# EAGLE schematic reg-board (EAGLE 8.7.0)

## Sheet 1 of 6: Bus Buffering
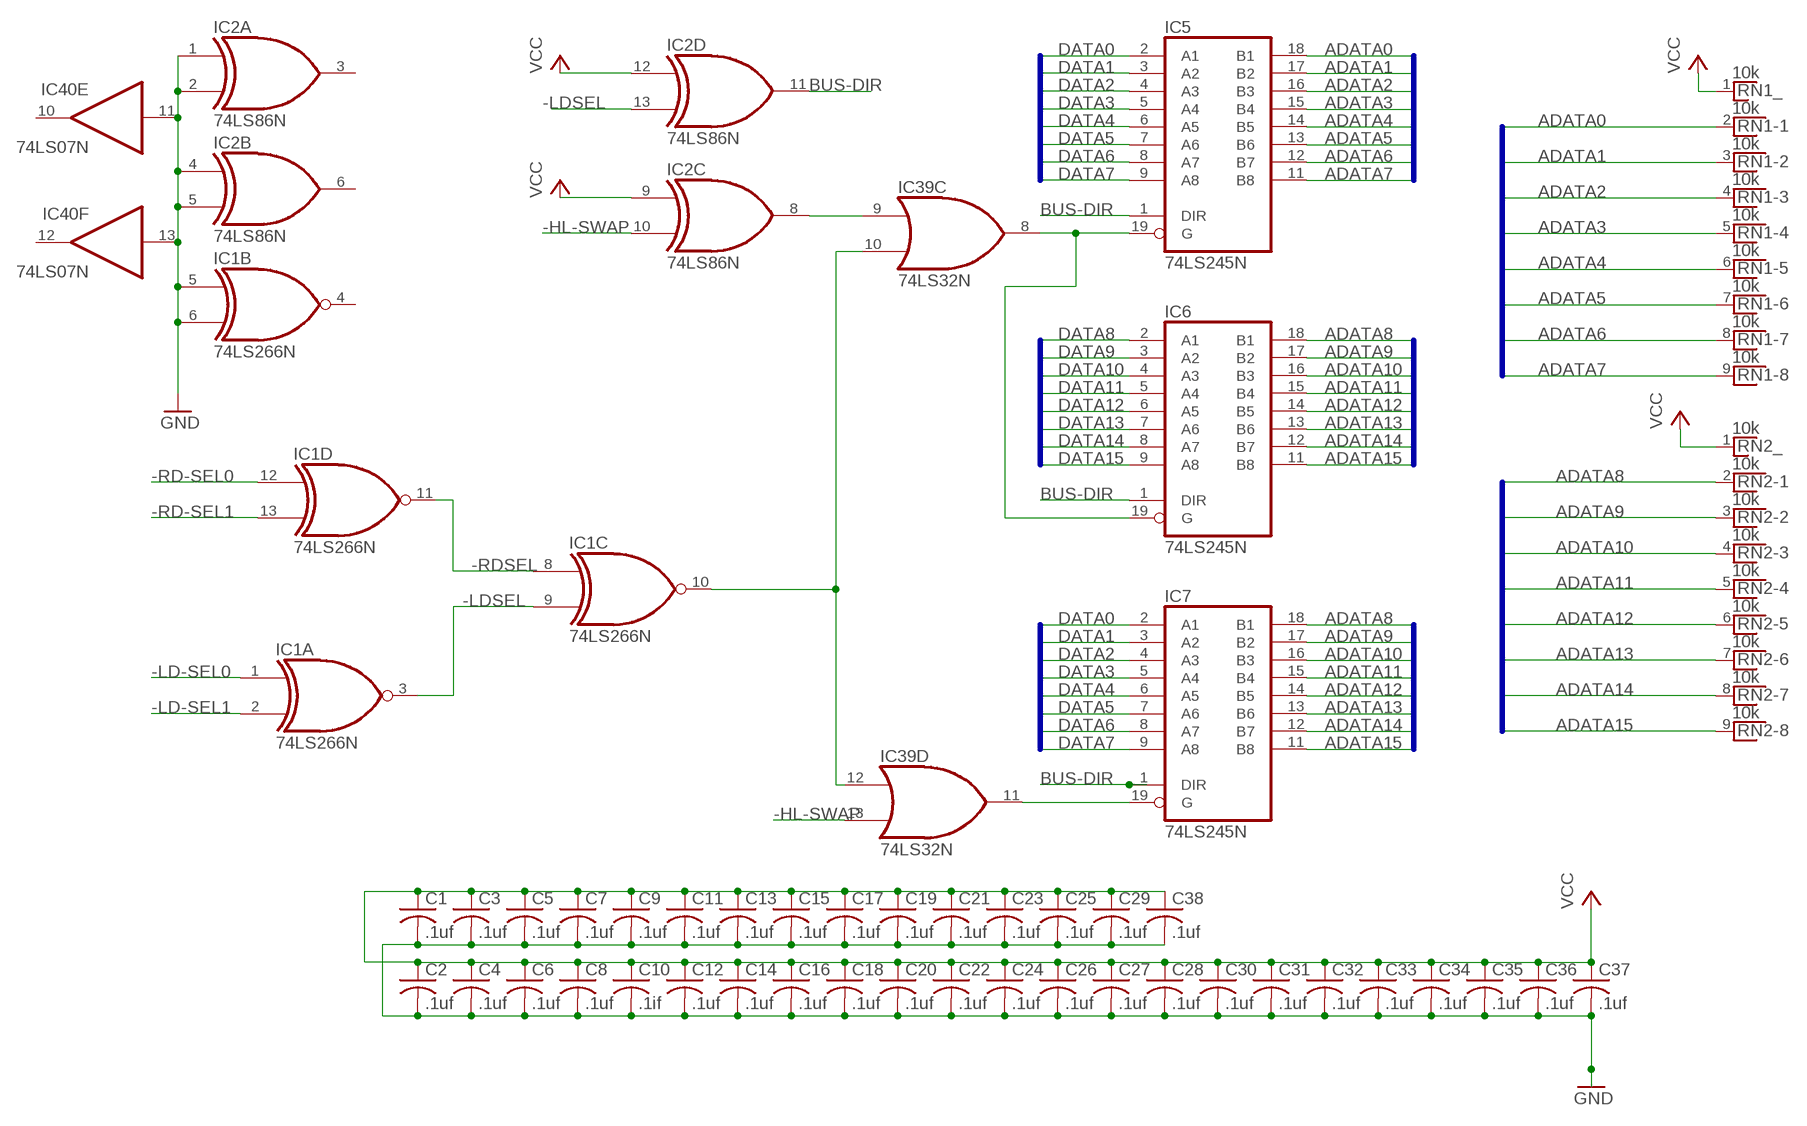
[diagram p0: schematic, sheet 1]

### Parts
C1  .1uf  C-US025-040X050  [C025-040X050]
C2  .1uf  C-US025-040X050  [C025-040X050]
C3  .1uf  C-US025-040X050  [C025-040X050]
C4  .1uf  C-US025-040X050  [C025-040X050]
C5  .1uf  C-US025-040X050  [C025-040X050]
C6  .1uf  C-US025-040X050  [C025-040X050]
C7  .1uf  C-US025-040X050  [C025-040X050]
C8  .1uf  C-US025-040X050  [C025-040X050]
C9  .1uf  C-US025-040X050  [C025-040X050]
C10  .1if  C-US025-040X050  [C025-040X050]
C11  .1uf  C-US025-040X050  [C025-040X050]
C12  .1uf  C-US025-040X050  [C025-040X050]
C13  .1uf  C-US025-040X050  [C025-040X050]
C14  .1uf  C-US025-040X050  [C025-040X050]
C15  .1uf  C-US025-040X050  [C025-040X050]
C16  .1uf  C-US025-040X050  [C025-040X050]
C17  .1uf  C-US025-040X050  [C025-040X050]
C18  .1uf  C-US025-040X050  [C025-040X050]
C19  .1uf  C-US025-040X050  [C025-040X050]
C20  .1uf  C-US025-040X050  [C025-040X050]
C21  .1uf  C-US025-040X050  [C025-040X050]
C22  .1uf  C-US025-040X050  [C025-040X050]
C23  .1uf  C-US025-040X050  [C025-040X050]
C24  .1uf  C-US025-040X050  [C025-040X050]
C25  .1uf  C-US025-040X050  [C025-040X050]
C26  .1uf  C-US025-040X050  [C025-040X050]
C27  .1uf  C-US025-040X050  [C025-040X050]
C28  .1uf  C-US025-040X050  [C025-040X050]
C29  .1uf  C-US025-040X050  [C025-040X050]
C30  .1uf  C-US025-040X050  [C025-040X050]
C31  .1uf  C-US025-040X050  [C025-040X050]
C32  .1uf  C-US025-040X050  [C025-040X050]
C33  .1uf  C-US025-040X050  [C025-040X050]
C34  .1uf  C-US025-040X050  [C025-040X050]
C35  .1uf  C-US025-040X050  [C025-040X050]
C36  .1uf  C-US025-040X050  [C025-040X050]
C37  .1uf  C-US025-040X050  [C025-040X050]
C38  .1uf  C-US025-040X050  [C025-040X050]
IC1  74LS266N  [DIL14]
IC2  74LS86N  [DIL14]
IC5  74LS245N  [DIL20]
IC6  74LS245N  [DIL20]
IC7  74LS245N  [DIL20]
IC39  74LS32N  [DIL14]
IC40  74LS07N  [DIL14]
RN1  10k  RNX8  [RN-9]
RN2  10k  RNX8  [RN-9]

### Nets
-HL-SWAP: IC2.10(C:I1) IC39.13(D:I1) ; also sheet 6
-LD-SEL0: IC1.1(A:I0) ; also sheet 5
-LD-SEL1: IC1.2(A:I1) ; also sheet 5
-LDSEL: IC1.3(A:O) IC1.9(C:I1) IC2.13(D:I1)
-RD-SEL0: IC1.12(D:I0) ; also sheet 5
-RD-SEL1: IC1.13(D:I1) ; also sheet 5
-RDSEL: IC1.8(C:I0) IC1.11(D:O)
ADATA0: IC5.18(B1) RN1.2 ; also sheet 2,3,4
ADATA1: IC5.17(B2) RN1.3 ; also sheet 2,3,4
ADATA2: IC5.16(B3) RN1.4 ; also sheet 2,3,4
ADATA3: IC5.15(B4) RN1.5 ; also sheet 2,3,4
ADATA4: IC5.14(B5) RN1.6 ; also sheet 2,3,4
ADATA5: IC5.13(B6) RN1.7 ; also sheet 2,3,4
ADATA6: IC5.12(B7) RN1.8 ; also sheet 2,3,4
ADATA7: IC5.11(B8) RN1.9 ; also sheet 2,3,4
ADATA8: IC6.18(B1) IC7.18(B1) RN2.2 ; also sheet 2,3,4
ADATA9: IC6.17(B2) IC7.17(B2) RN2.3 ; also sheet 2,3,4
ADATA10: IC6.16(B3) IC7.16(B3) RN2.4 ; also sheet 2,3,4
ADATA11: IC6.15(B4) IC7.15(B4) RN2.5 ; also sheet 2,3,4
ADATA12: IC6.14(B5) IC7.14(B5) RN2.6 ; also sheet 2,3,4
ADATA13: IC6.13(B6) IC7.13(B6) RN2.7 ; also sheet 2,3,4
ADATA14: IC6.12(B7) IC7.12(B7) RN2.8 ; also sheet 2,3,4
ADATA15: IC6.11(B8) IC7.11(B8) RN2.9 ; also sheet 2,3,4
BUS-DIR: IC2.11(D:O) IC5.1(DIR) IC6.1(DIR) IC7.1(DIR)
DATA0: IC5.2(A1) IC7.2(A1) ; also sheet 6
DATA1: IC5.3(A2) IC7.3(A2) ; also sheet 6
DATA2: IC5.4(A3) IC7.4(A3) ; also sheet 6
DATA3: IC5.5(A4) IC7.5(A4) ; also sheet 6
DATA4: IC5.6(A5) IC7.6(A5) ; also sheet 6
DATA5: IC5.7(A6) IC7.7(A6) ; also sheet 6
DATA6: IC5.8(A7) IC7.8(A7) ; also sheet 6
DATA7: IC5.9(A8) IC7.9(A8) ; also sheet 6
DATA8: IC6.2(A1) ; also sheet 6
DATA9: IC6.3(A2) ; also sheet 6
DATA10: IC6.4(A3) ; also sheet 6
DATA11: IC6.5(A4) ; also sheet 6
DATA12: IC6.6(A5) ; also sheet 6
DATA13: IC6.7(A6) ; also sheet 6
DATA14: IC6.8(A7) ; also sheet 6
DATA15: IC6.9(A8) ; also sheet 6
GND: C1.2 C2.2 C3.2 C4.2 C5.2 C6.2 C7.2 C8.2 C9.2 C10.2 C11.2 C12.2 C13.2 C14.2 C15.2 C16.2 C17.2 C18.2 C19.2 C20.2 C21.2 C22.2 C23.2 C24.2 C25.2 C26.2 C27.2 C28.2 C29.2 C30.2 C31.2 C32.2 C33.2 C34.2 C35.2 C36.2 C37.2 C38.2 IC1.5(B:I0) IC1.6(B:I1) IC2.1(A:I0) IC2.2(A:I1) IC2.4(B:I0) IC2.5(B:I1) IC40.11(E:I) IC40.13(F:I) ; also sheet 4,6
N$2: IC1.10(C:O) IC39.10(C:I1) IC39.12(D:I0)
N$37: IC7.19(G) IC39.11(D:O)
N$38: IC5.19(G) IC6.19(G) IC39.8(C:O)
N$41: IC2.8(C:O) IC39.9(C:I0)
VCC: C1.1 C2.1 C3.1 C4.1 C5.1 C6.1 C7.1 C8.1 C9.1 C10.1 C11.1 C12.1 C13.1 C14.1 C15.1 C16.1 C17.1 C18.1 C19.1 C20.1 C21.1 C22.1 C23.1 C24.1 C25.1 C26.1 C27.1 C28.1 C29.1 C30.1 C31.1 C32.1 C33.1 C34.1 C35.1 C36.1 C37.1 C38.1 IC2.9(C:I0) IC2.12(D:I0) RN1.1 RN2.1 ; also sheet 4,5,6
Unconnected: IC1.4(B:O) IC2.3(A:O) IC2.6(B:O) IC40.10(E:O) IC40.12(F:O)

### Buses
DATA[8..15]
DATA[0..7]
ADATA[0..7]
ADATA[8..15]

## Sheet 2 of 6: REGISTER FILE 1/2
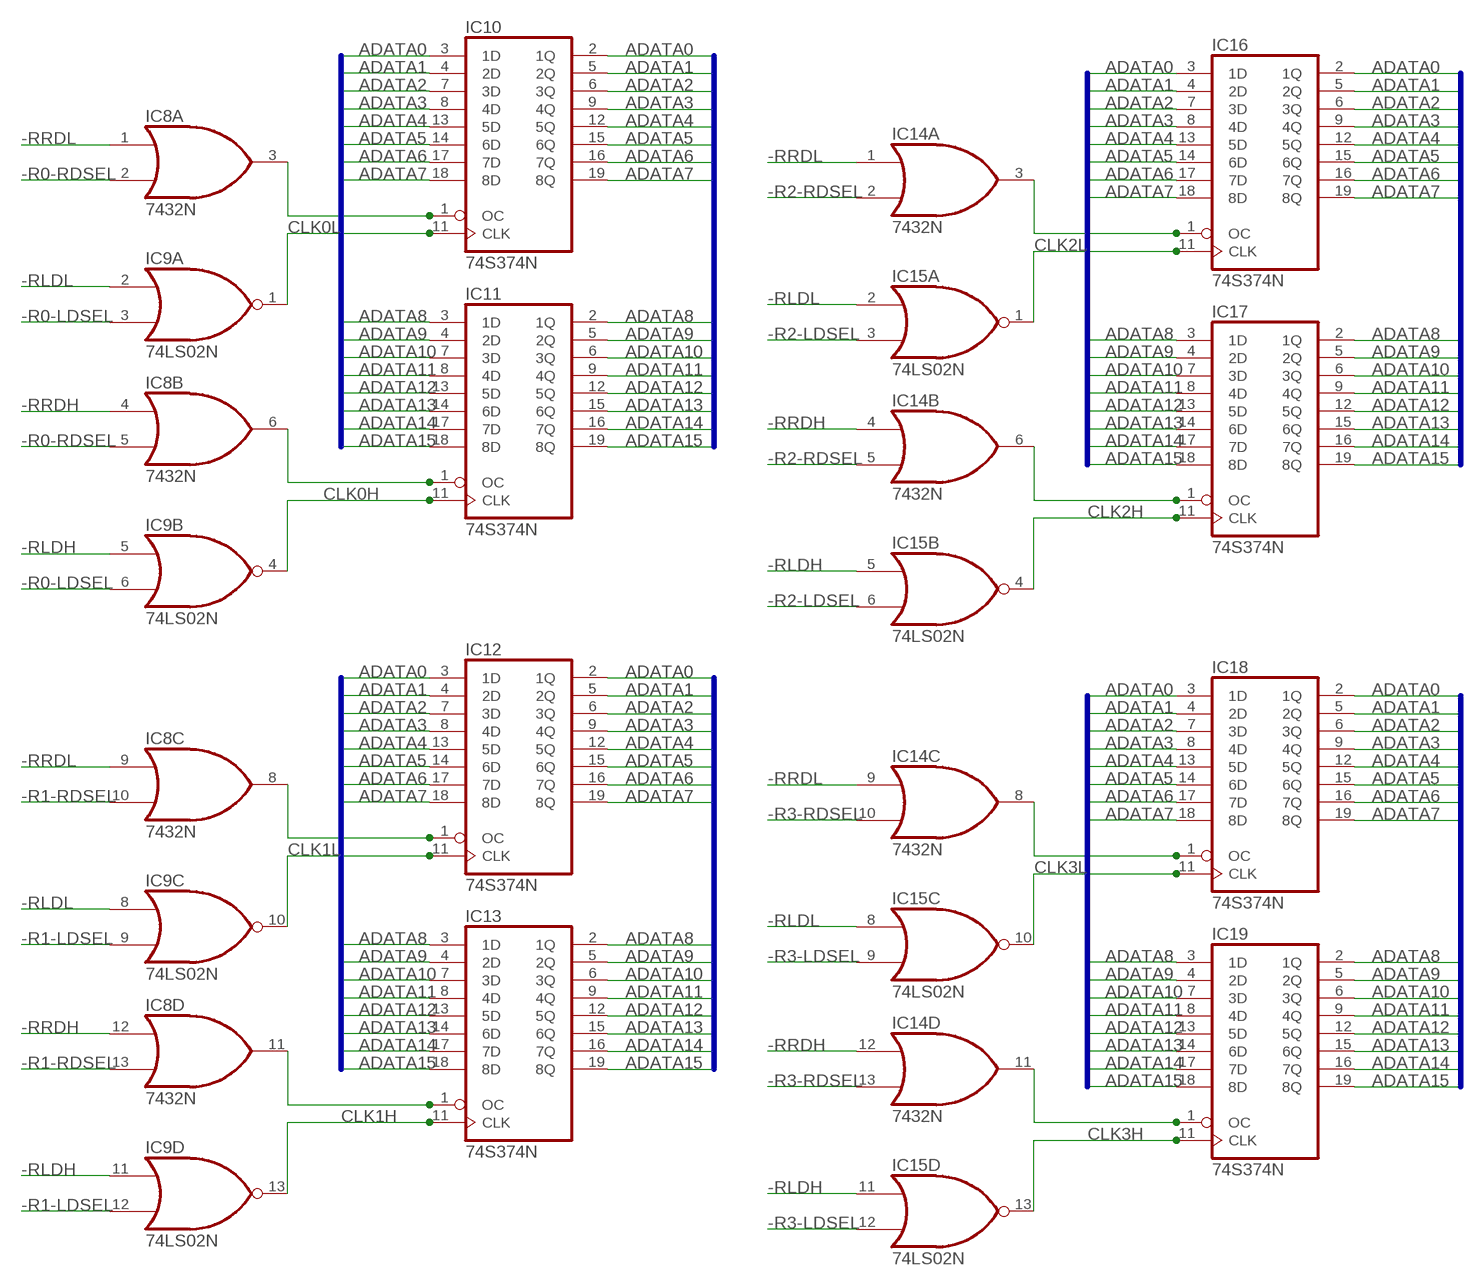
[diagram p1: schematic, sheet 2]

### Parts
IC8  7432N  [DIL14]
IC9  74LS02N  [DIL14]
IC10  74S374N  [DIL20]
IC11  74S374N  [DIL20]
IC12  74S374N  [DIL20]
IC13  74S374N  [DIL20]
IC14  7432N  [DIL14]
IC15  74LS02N  [DIL14]
IC16  74S374N  [DIL20]
IC17  74S374N  [DIL20]
IC18  74S374N  [DIL20]
IC19  74S374N  [DIL20]

### Nets
-R0-LDSEL: IC9.3(A:I1) IC9.6(B:I1) ; also sheet 5
-R0-RDSEL: IC8.2(A:I1) IC8.5(B:I1) ; also sheet 5
-R1-LDSEL: IC9.9(C:I1) IC9.12(D:I1) ; also sheet 5
-R1-RDSEL: IC8.10(C:I1) IC8.13(D:I1) ; also sheet 5
-R2-LDSEL: IC15.3(A:I1) IC15.6(B:I1) ; also sheet 5
-R2-RDSEL: IC14.2(A:I1) IC14.5(B:I1) ; also sheet 5
-R3-LDSEL: IC15.9(C:I1) IC15.12(D:I1) ; also sheet 5
-R3-RDSEL: IC14.10(C:I1) IC14.13(D:I1) ; also sheet 5
-RLDH: IC9.5(B:I0) IC9.11(D:I0) IC15.5(B:I0) IC15.11(D:I0) ; also sheet 3,5
-RLDL: IC9.2(A:I0) IC9.8(C:I0) IC15.2(A:I0) IC15.8(C:I0) ; also sheet 3,5
-RRDH: IC8.4(B:I0) IC8.12(D:I0) IC14.4(B:I0) IC14.12(D:I0) ; also sheet 3,5
-RRDL: IC8.1(A:I0) IC8.9(C:I0) IC14.1(A:I0) IC14.9(C:I0) ; also sheet 3,5
ADATA0: IC10.2(1Q) IC10.3(1D) IC12.2(1Q) IC12.3(1D) IC16.2(1Q) IC16.3(1D) IC18.2(1Q) IC18.3(1D) ; also sheet 1,3,4
ADATA1: IC10.4(2D) IC10.5(2Q) IC12.4(2D) IC12.5(2Q) IC16.4(2D) IC16.5(2Q) IC18.4(2D) IC18.5(2Q) ; also sheet 1,3,4
ADATA2: IC10.6(3Q) IC10.7(3D) IC12.6(3Q) IC12.7(3D) IC16.6(3Q) IC16.7(3D) IC18.6(3Q) IC18.7(3D) ; also sheet 1,3,4
ADATA3: IC10.8(4D) IC10.9(4Q) IC12.8(4D) IC12.9(4Q) IC16.8(4D) IC16.9(4Q) IC18.8(4D) IC18.9(4Q) ; also sheet 1,3,4
ADATA4: IC10.12(5Q) IC10.13(5D) IC12.12(5Q) IC12.13(5D) IC16.12(5Q) IC16.13(5D) IC18.12(5Q) IC18.13(5D) ; also sheet 1,3,4
ADATA5: IC10.14(6D) IC10.15(6Q) IC12.14(6D) IC12.15(6Q) IC16.14(6D) IC16.15(6Q) IC18.14(6D) IC18.15(6Q) ; also sheet 1,3,4
ADATA6: IC10.16(7Q) IC10.17(7D) IC12.16(7Q) IC12.17(7D) IC16.16(7Q) IC16.17(7D) IC18.16(7Q) IC18.17(7D) ; also sheet 1,3,4
ADATA7: IC10.18(8D) IC10.19(8Q) IC12.18(8D) IC12.19(8Q) IC16.18(8D) IC16.19(8Q) IC18.18(8D) IC18.19(8Q) ; also sheet 1,3,4
ADATA8: IC11.2(1Q) IC11.3(1D) IC13.2(1Q) IC13.3(1D) IC17.2(1Q) IC17.3(1D) IC19.2(1Q) IC19.3(1D) ; also sheet 1,3,4
ADATA9: IC11.4(2D) IC11.5(2Q) IC13.4(2D) IC13.5(2Q) IC17.4(2D) IC17.5(2Q) IC19.4(2D) IC19.5(2Q) ; also sheet 1,3,4
ADATA10: IC11.6(3Q) IC11.7(3D) IC13.6(3Q) IC13.7(3D) IC17.6(3Q) IC17.7(3D) IC19.6(3Q) IC19.7(3D) ; also sheet 1,3,4
ADATA11: IC11.8(4D) IC11.9(4Q) IC13.8(4D) IC13.9(4Q) IC17.8(4D) IC17.9(4Q) IC19.8(4D) IC19.9(4Q) ; also sheet 1,3,4
ADATA12: IC11.12(5Q) IC11.13(5D) IC13.12(5Q) IC13.13(5D) IC17.12(5Q) IC17.13(5D) IC19.12(5Q) IC19.13(5D) ; also sheet 1,3,4
ADATA13: IC11.14(6D) IC11.15(6Q) IC13.14(6D) IC13.15(6Q) IC17.14(6D) IC17.15(6Q) IC19.14(6D) IC19.15(6Q) ; also sheet 1,3,4
ADATA14: IC11.16(7Q) IC11.17(7D) IC13.16(7Q) IC13.17(7D) IC17.16(7Q) IC17.17(7D) IC19.16(7Q) IC19.17(7D) ; also sheet 1,3,4
ADATA15: IC11.18(8D) IC11.19(8Q) IC13.18(8D) IC13.19(8Q) IC17.18(8D) IC17.19(8Q) IC19.18(8D) IC19.19(8Q) ; also sheet 1,3,4
CLK0H: IC9.4(B:O) IC11.11(CLK) ; also sheet 4
CLK0L: IC9.1(A:O) IC10.11(CLK) ; also sheet 4
CLK1H: IC9.13(D:O) IC13.11(CLK) ; also sheet 4
CLK1L: IC9.10(C:O) IC12.11(CLK) ; also sheet 4
CLK2H: IC15.4(B:O) IC17.11(CLK) ; also sheet 4
CLK2L: IC15.1(A:O) IC16.11(CLK) ; also sheet 4
CLK3H: IC15.13(D:O) IC19.11(CLK) ; also sheet 4
CLK3L: IC15.10(C:O) IC18.11(CLK) ; also sheet 4
N$1: IC8.3(A:O) IC10.1(OC)
N$12: IC8.8(C:O) IC12.1(OC)
N$15: IC14.3(A:O) IC16.1(OC)
N$17: IC14.8(C:O) IC18.1(OC)
N$19: IC8.11(D:O) IC13.1(OC)
N$21: IC14.11(D:O) IC19.1(OC)
N$23: IC14.6(B:O) IC17.1(OC)
N$25: IC8.6(B:O) IC11.1(OC)

### Buses
ADATA[0..15]

## Sheet 3 of 6: REGISTER FILE 2/2
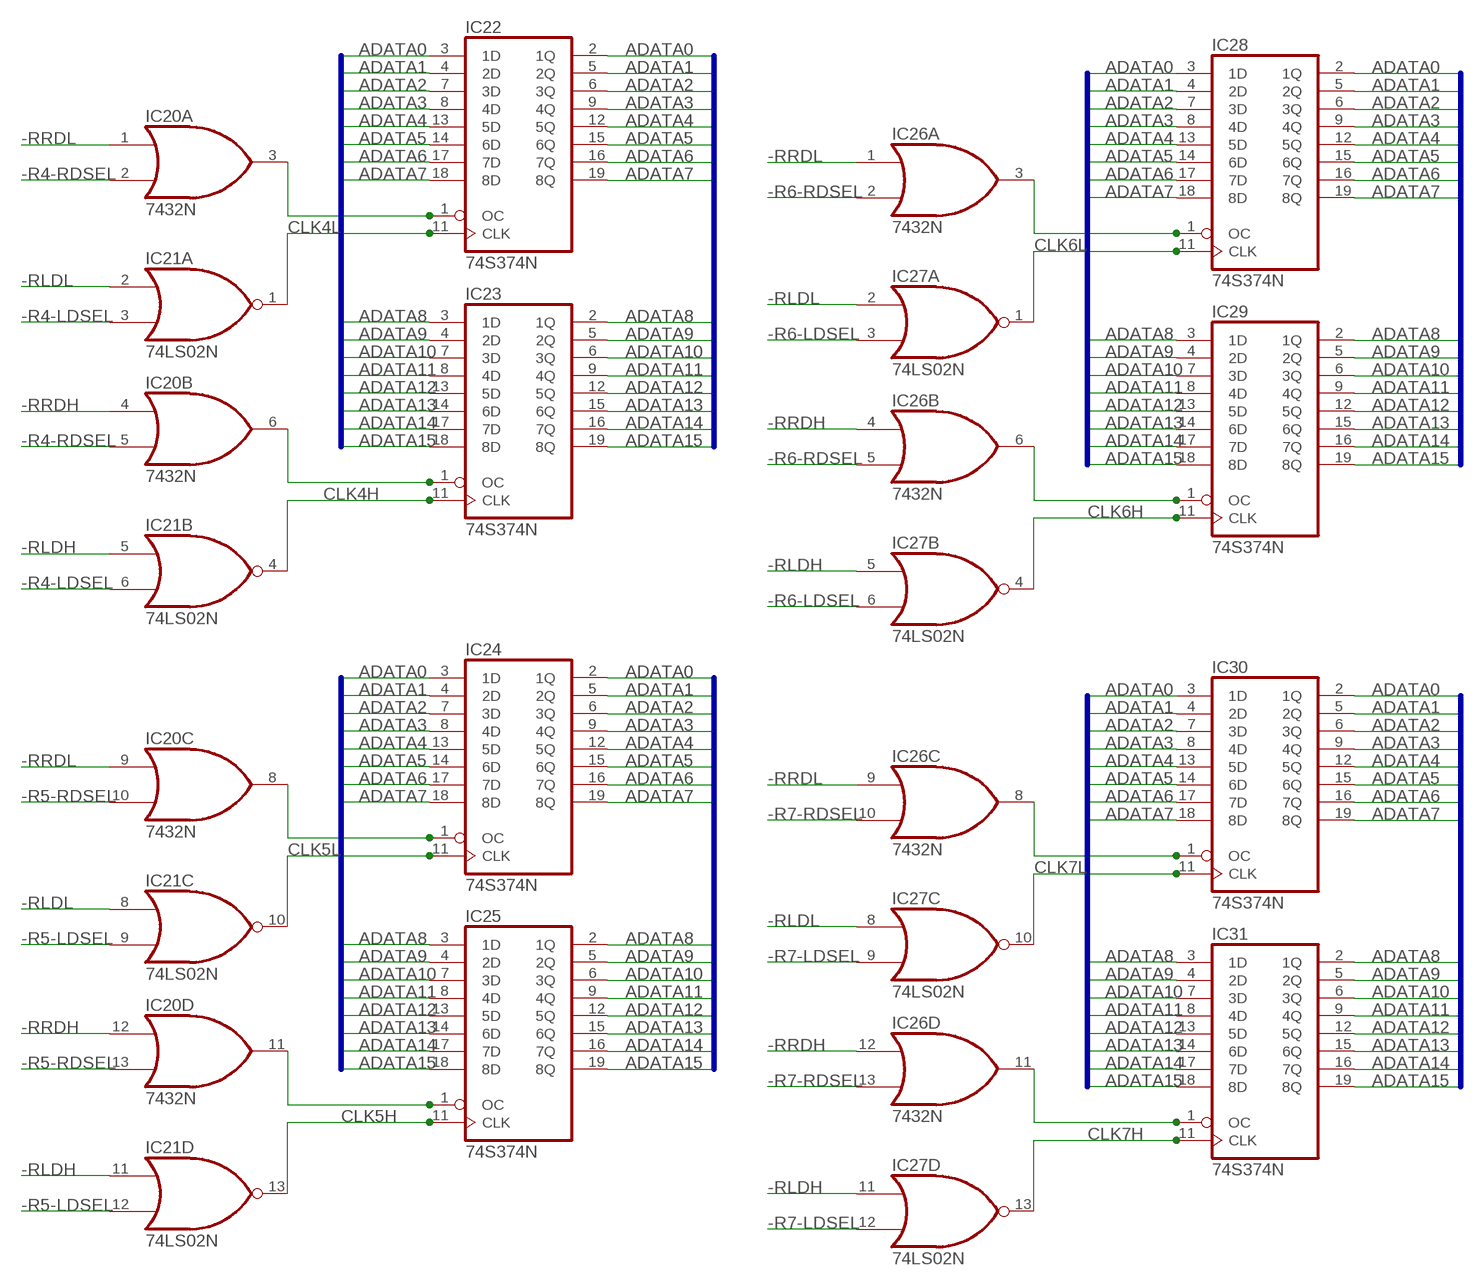
[diagram p2: schematic, sheet 3]

### Parts
IC20  7432N  [DIL14]
IC21  74LS02N  [DIL14]
IC22  74S374N  [DIL20]
IC23  74S374N  [DIL20]
IC24  74S374N  [DIL20]
IC25  74S374N  [DIL20]
IC26  7432N  [DIL14]
IC27  74LS02N  [DIL14]
IC28  74S374N  [DIL20]
IC29  74S374N  [DIL20]
IC30  74S374N  [DIL20]
IC31  74S374N  [DIL20]

### Nets
-R4-LDSEL: IC21.3(A:I1) IC21.6(B:I1) ; also sheet 5
-R4-RDSEL: IC20.2(A:I1) IC20.5(B:I1) ; also sheet 5
-R5-LDSEL: IC21.9(C:I1) IC21.12(D:I1) ; also sheet 5
-R5-RDSEL: IC20.10(C:I1) IC20.13(D:I1) ; also sheet 5
-R6-LDSEL: IC27.3(A:I1) IC27.6(B:I1) ; also sheet 5
-R6-RDSEL: IC26.2(A:I1) IC26.5(B:I1) ; also sheet 5
-R7-LDSEL: IC27.9(C:I1) IC27.12(D:I1) ; also sheet 5
-R7-RDSEL: IC26.10(C:I1) IC26.13(D:I1) ; also sheet 5
-RLDH: IC21.5(B:I0) IC21.11(D:I0) IC27.5(B:I0) IC27.11(D:I0) ; also sheet 2,5
-RLDL: IC21.2(A:I0) IC21.8(C:I0) IC27.2(A:I0) IC27.8(C:I0) ; also sheet 2,5
-RRDH: IC20.4(B:I0) IC20.12(D:I0) IC26.4(B:I0) IC26.12(D:I0) ; also sheet 2,5
-RRDL: IC20.1(A:I0) IC20.9(C:I0) IC26.1(A:I0) IC26.9(C:I0) ; also sheet 2,5
ADATA0: IC22.2(1Q) IC22.3(1D) IC24.2(1Q) IC24.3(1D) IC28.2(1Q) IC28.3(1D) IC30.2(1Q) IC30.3(1D) ; also sheet 1,2,4
ADATA1: IC22.4(2D) IC22.5(2Q) IC24.4(2D) IC24.5(2Q) IC28.4(2D) IC28.5(2Q) IC30.4(2D) IC30.5(2Q) ; also sheet 1,2,4
ADATA2: IC22.6(3Q) IC22.7(3D) IC24.6(3Q) IC24.7(3D) IC28.6(3Q) IC28.7(3D) IC30.6(3Q) IC30.7(3D) ; also sheet 1,2,4
ADATA3: IC22.8(4D) IC22.9(4Q) IC24.8(4D) IC24.9(4Q) IC28.8(4D) IC28.9(4Q) IC30.8(4D) IC30.9(4Q) ; also sheet 1,2,4
ADATA4: IC22.12(5Q) IC22.13(5D) IC24.12(5Q) IC24.13(5D) IC28.12(5Q) IC28.13(5D) IC30.12(5Q) IC30.13(5D) ; also sheet 1,2,4
ADATA5: IC22.14(6D) IC22.15(6Q) IC24.14(6D) IC24.15(6Q) IC28.14(6D) IC28.15(6Q) IC30.14(6D) IC30.15(6Q) ; also sheet 1,2,4
ADATA6: IC22.16(7Q) IC22.17(7D) IC24.16(7Q) IC24.17(7D) IC28.16(7Q) IC28.17(7D) IC30.16(7Q) IC30.17(7D) ; also sheet 1,2,4
ADATA7: IC22.18(8D) IC22.19(8Q) IC24.18(8D) IC24.19(8Q) IC28.18(8D) IC28.19(8Q) IC30.18(8D) IC30.19(8Q) ; also sheet 1,2,4
ADATA8: IC23.2(1Q) IC23.3(1D) IC25.2(1Q) IC25.3(1D) IC29.2(1Q) IC29.3(1D) IC31.2(1Q) IC31.3(1D) ; also sheet 1,2,4
ADATA9: IC23.4(2D) IC23.5(2Q) IC25.4(2D) IC25.5(2Q) IC29.4(2D) IC29.5(2Q) IC31.4(2D) IC31.5(2Q) ; also sheet 1,2,4
ADATA10: IC23.6(3Q) IC23.7(3D) IC25.6(3Q) IC25.7(3D) IC29.6(3Q) IC29.7(3D) IC31.6(3Q) IC31.7(3D) ; also sheet 1,2,4
ADATA11: IC23.8(4D) IC23.9(4Q) IC25.8(4D) IC25.9(4Q) IC29.8(4D) IC29.9(4Q) IC31.8(4D) IC31.9(4Q) ; also sheet 1,2,4
ADATA12: IC23.12(5Q) IC23.13(5D) IC25.12(5Q) IC25.13(5D) IC29.12(5Q) IC29.13(5D) IC31.12(5Q) IC31.13(5D) ; also sheet 1,2,4
ADATA13: IC23.14(6D) IC23.15(6Q) IC25.14(6D) IC25.15(6Q) IC29.14(6D) IC29.15(6Q) IC31.14(6D) IC31.15(6Q) ; also sheet 1,2,4
ADATA14: IC23.16(7Q) IC23.17(7D) IC25.16(7Q) IC25.17(7D) IC29.16(7Q) IC29.17(7D) IC31.16(7Q) IC31.17(7D) ; also sheet 1,2,4
ADATA15: IC23.18(8D) IC23.19(8Q) IC25.18(8D) IC25.19(8Q) IC29.18(8D) IC29.19(8Q) IC31.18(8D) IC31.19(8Q) ; also sheet 1,2,4
CLK4H: IC21.4(B:O) IC23.11(CLK) ; also sheet 4
CLK4L: IC21.1(A:O) IC22.11(CLK) ; also sheet 4
CLK5H: IC21.13(D:O) IC25.11(CLK) ; also sheet 4
CLK5L: IC21.10(C:O) IC24.11(CLK) ; also sheet 4
CLK6H: IC27.4(B:O) IC29.11(CLK) ; also sheet 4
CLK6L: IC27.1(A:O) IC28.11(CLK) ; also sheet 4
CLK7H: IC27.13(D:O) IC31.11(CLK) ; also sheet 4
CLK7L: IC27.10(C:O) IC30.11(CLK) ; also sheet 4
N$10: IC20.3(A:O) IC22.1(OC)
N$45: IC20.8(C:O) IC24.1(OC)
N$46: IC26.3(A:O) IC28.1(OC)
N$47: IC26.8(C:O) IC30.1(OC)
N$48: IC20.11(D:O) IC25.1(OC)
N$49: IC26.11(D:O) IC31.1(OC)
N$50: IC26.6(B:O) IC29.1(OC)
N$51: IC20.6(B:O) IC23.1(OC)

### Buses
ADATA[0..15]

## Sheet 4 of 6: FRONT PANEL CONNECTOR
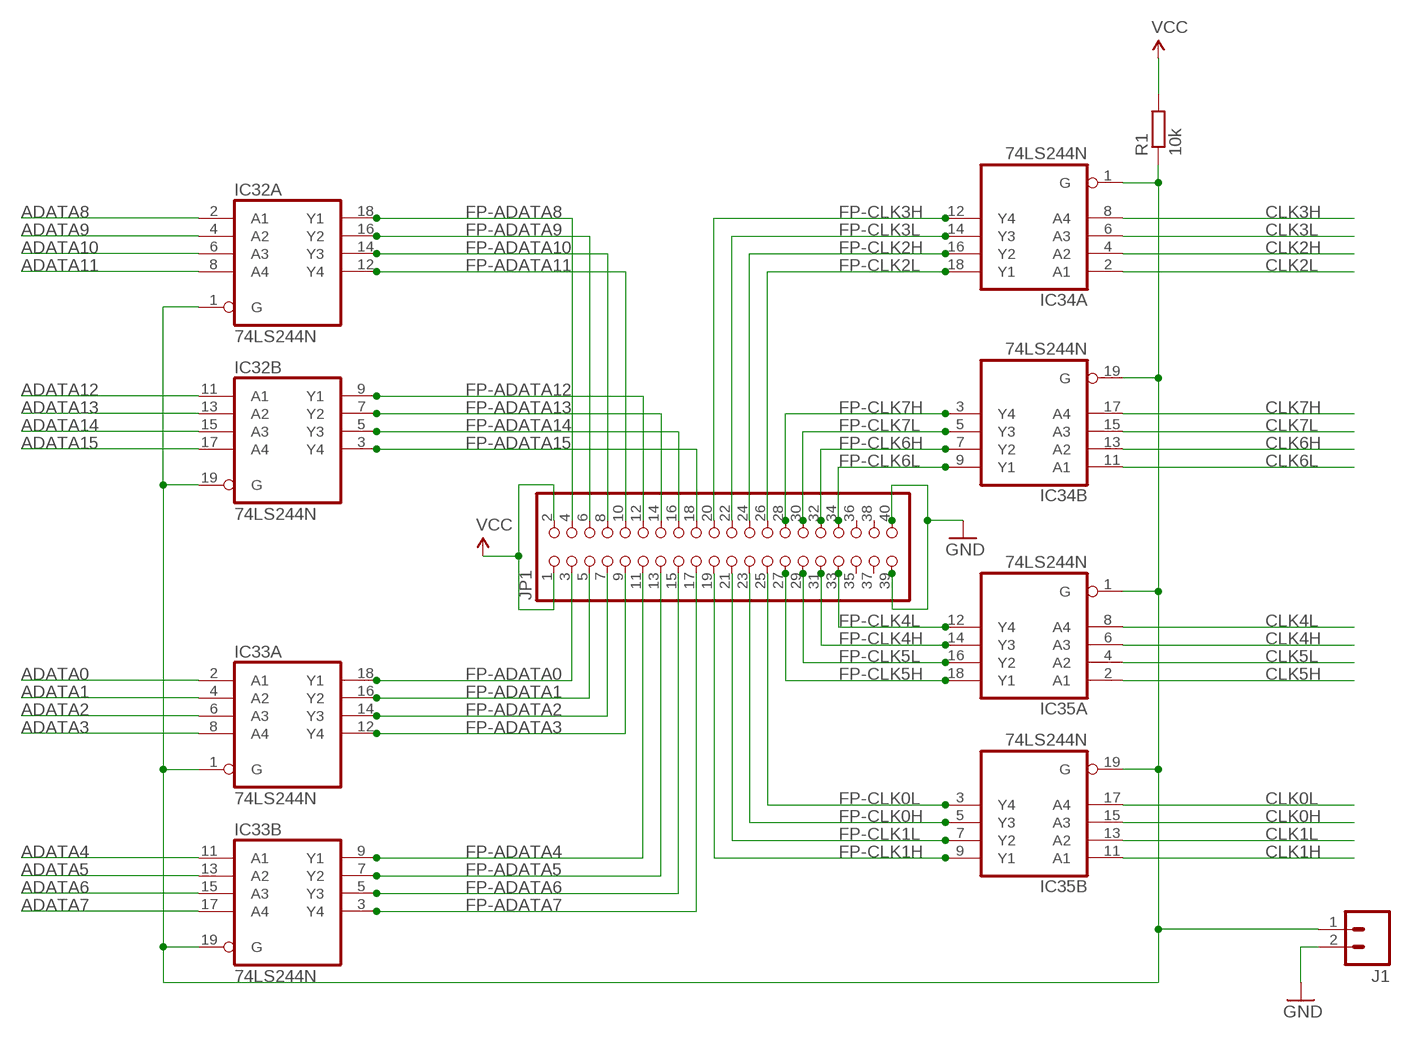
[diagram p3: schematic, sheet 4]

### Parts
IC32  74LS244N  [DIL20]
IC33  74LS244N  [DIL20]
IC34  74LS244N  [DIL20]
IC35  74LS244N  [DIL20]
J1  M02PTH  [1X02]
JP1  PINHD-2X20  [2X20]
R1  10k  R0207/10  [0207/10]

### Nets
ADATA0: IC33.2(A:A1) ; also sheet 1,2,3
ADATA1: IC33.4(A:A2) ; also sheet 1,2,3
ADATA2: IC33.6(A:A3) ; also sheet 1,2,3
ADATA3: IC33.8(A:A4) ; also sheet 1,2,3
ADATA4: IC33.11(B:A1) ; also sheet 1,2,3
ADATA5: IC33.13(B:A2) ; also sheet 1,2,3
ADATA6: IC33.15(B:A3) ; also sheet 1,2,3
ADATA7: IC33.17(B:A4) ; also sheet 1,2,3
ADATA8: IC32.2(A:A1) ; also sheet 1,2,3
ADATA9: IC32.4(A:A2) ; also sheet 1,2,3
ADATA10: IC32.6(A:A3) ; also sheet 1,2,3
ADATA11: IC32.8(A:A4) ; also sheet 1,2,3
ADATA12: IC32.11(B:A1) ; also sheet 1,2,3
ADATA13: IC32.13(B:A2) ; also sheet 1,2,3
ADATA14: IC32.15(B:A3) ; also sheet 1,2,3
ADATA15: IC32.17(B:A4) ; also sheet 1,2,3
CLK0H: IC35.15(B:A3) ; also sheet 2
CLK0L: IC35.17(B:A4) ; also sheet 2
CLK1H: IC35.11(B:A1) ; also sheet 2
CLK1L: IC35.13(B:A2) ; also sheet 2
CLK2H: IC34.4(A:A2) ; also sheet 2
CLK2L: IC34.2(A:A1) ; also sheet 2
CLK3H: IC34.8(A:A4) ; also sheet 2
CLK3L: IC34.6(A:A3) ; also sheet 2
CLK4H: IC35.6(A:A3) ; also sheet 3
CLK4L: IC35.8(A:A4) ; also sheet 3
CLK5H: IC35.2(A:A1) ; also sheet 3
CLK5L: IC35.4(A:A2) ; also sheet 3
CLK6H: IC34.13(B:A2) ; also sheet 3
CLK6L: IC34.11(B:A1) ; also sheet 3
CLK7H: IC34.17(B:A4) ; also sheet 3
CLK7L: IC34.15(B:A3) ; also sheet 3
FP-ADATA0: IC33.18(A:Y1) JP1.3
FP-ADATA1: IC33.16(A:Y2) JP1.5
FP-ADATA2: IC33.14(A:Y3) JP1.7
FP-ADATA3: IC33.12(A:Y4) JP1.9
FP-ADATA4: IC33.9(B:Y1) JP1.11
FP-ADATA5: IC33.7(B:Y2) JP1.13
FP-ADATA6: IC33.5(B:Y3) JP1.15
FP-ADATA7: IC33.3(B:Y4) JP1.17
FP-ADATA8: IC32.18(A:Y1) JP1.4
FP-ADATA9: IC32.16(A:Y2) JP1.6
FP-ADATA10: IC32.14(A:Y3) JP1.8
FP-ADATA11: IC32.12(A:Y4) JP1.10
FP-ADATA12: IC32.9(B:Y1) JP1.12
FP-ADATA13: IC32.7(B:Y2) JP1.14
FP-ADATA14: IC32.5(B:Y3) JP1.16
FP-ADATA15: IC32.3(B:Y4) JP1.18
FP-CLK0H: IC35.5(B:Y3) JP1.23
FP-CLK0L: IC35.3(B:Y4) JP1.25
FP-CLK1H: IC35.9(B:Y1) JP1.19
FP-CLK1L: IC35.7(B:Y2) JP1.21
FP-CLK2H: IC34.16(A:Y2) JP1.24
FP-CLK2L: IC34.18(A:Y1) JP1.26
FP-CLK3H: IC34.12(A:Y4) JP1.20
FP-CLK3L: IC34.14(A:Y3) JP1.22
FP-CLK4H: IC35.14(A:Y3) JP1.31
FP-CLK4L: IC35.12(A:Y4) JP1.33
FP-CLK5H: IC35.18(A:Y1) JP1.27
FP-CLK5L: IC35.16(A:Y2) JP1.29
FP-CLK6H: IC34.7(B:Y2) JP1.32
FP-CLK6L: IC34.9(B:Y1) JP1.34
FP-CLK7H: IC34.3(B:Y4) JP1.28
FP-CLK7L: IC34.5(B:Y3) JP1.30
GND: J1.2 JP1.39 JP1.40 ; also sheet 1,6
N$8: IC32.1(A:G) IC32.19(B:G) IC33.1(A:G) IC33.19(B:G) IC34.1(A:G) IC34.19(B:G) IC35.1(A:G) IC35.19(B:G) J1.1 R1.1
VCC: JP1.1 JP1.2 R1.2 ; also sheet 1,5,6
Unconnected: JP1.35 JP1.36 JP1.37 JP1.38

## Sheet 5 of 6: SELECTION
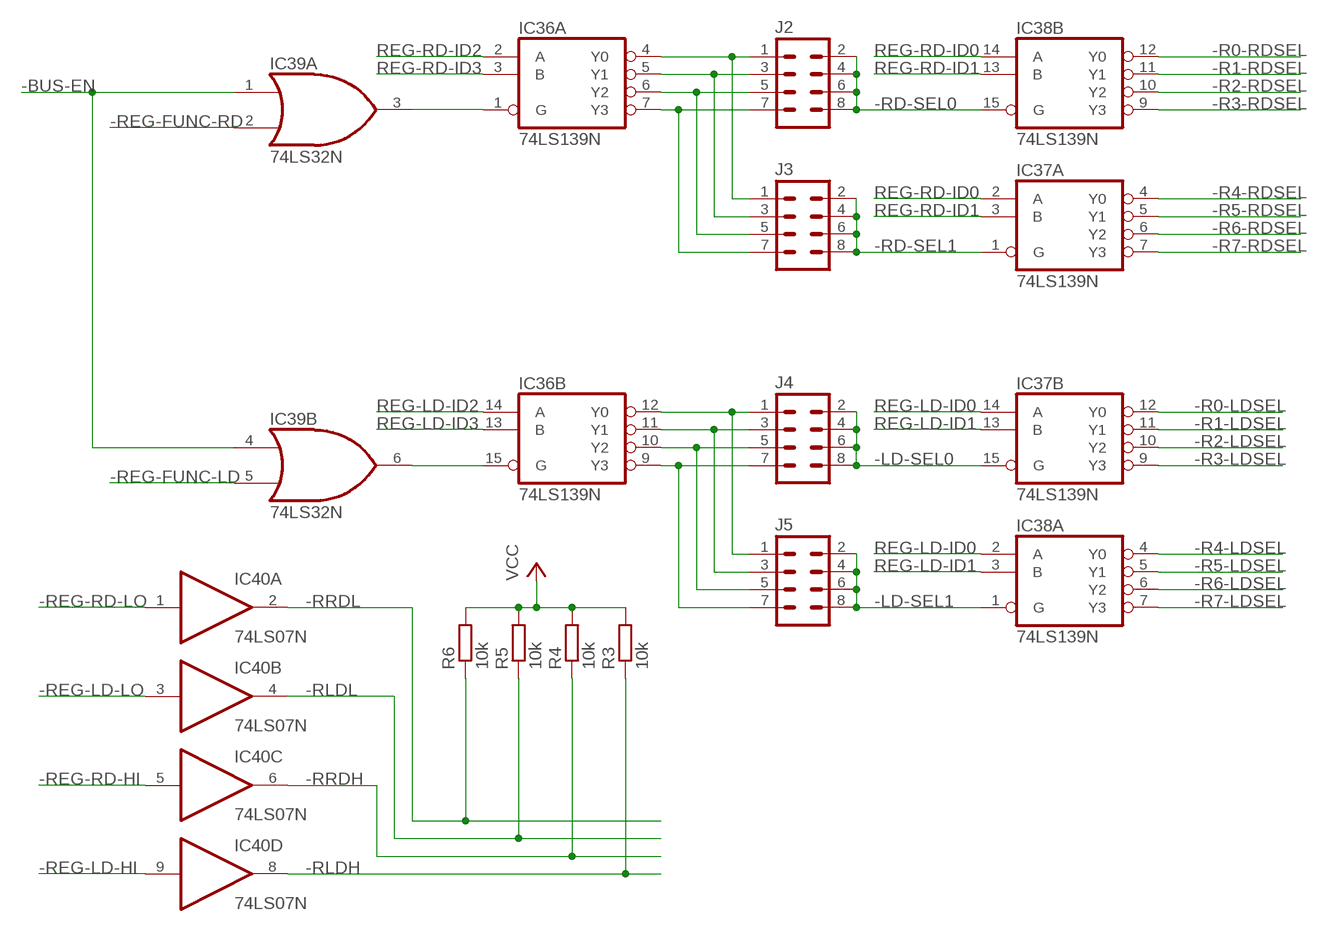
[diagram p4: schematic, sheet 5]

### Parts
IC36  74LS139N  [DIL16]
IC37  74LS139N  [DIL16]
IC38  74LS139N  [DIL16]
J2  M04X2  [2X4]
J3  M04X2  [2X4]
J4  M04X2  [2X4]
J5  M04X2  [2X4]
R3  10k  R0207/10  [0207/10]
R4  10k  R0207/10  [0207/10]
R5  10k  R0207/10  [0207/10]
R6  10k  R0207/10  [0207/10]

### Nets
-BUS-EN: IC39.1(A:I0) IC39.4(B:I0) ; also sheet 6
-LD-SEL0: IC37.15(B:G) J4.2 J4.4 J4.6 J4.8 ; also sheet 1
-LD-SEL1: IC38.1(A:G) J5.2 J5.4 J5.6 J5.8 ; also sheet 1
-R0-LDSEL: IC37.12(B:Y0) ; also sheet 2
-R0-RDSEL: IC38.12(B:Y0) ; also sheet 2
-R1-LDSEL: IC37.11(B:Y1) ; also sheet 2
-R1-RDSEL: IC38.11(B:Y1) ; also sheet 2
-R2-LDSEL: IC37.10(B:Y2) ; also sheet 2
-R2-RDSEL: IC38.10(B:Y2) ; also sheet 2
-R3-LDSEL: IC37.9(B:Y3) ; also sheet 2
-R3-RDSEL: IC38.9(B:Y3) ; also sheet 2
-R4-LDSEL: IC38.4(A:Y0) ; also sheet 3
-R4-RDSEL: IC37.4(A:Y0) ; also sheet 3
-R5-LDSEL: IC38.5(A:Y1) ; also sheet 3
-R5-RDSEL: IC37.5(A:Y1) ; also sheet 3
-R6-LDSEL: IC38.6(A:Y2) ; also sheet 3
-R6-RDSEL: IC37.6(A:Y2) ; also sheet 3
-R7-LDSEL: IC38.7(A:Y3) ; also sheet 3
-R7-RDSEL: IC37.7(A:Y3) ; also sheet 3
-RD-SEL0: IC38.15(B:G) J2.2 J2.4 J2.6 J2.8 ; also sheet 1
-RD-SEL1: IC37.1(A:G) J3.2 J3.4 J3.6 J3.8 ; also sheet 1
-REG-FUNC-LD: IC39.5(B:I1) ; also sheet 6
-REG-FUNC-RD: IC39.2(A:I1) ; also sheet 6
-REG-LD-HI: IC40.9(D:I) ; also sheet 6
-REG-LD-LO: IC40.3(B:I) ; also sheet 6
-REG-RD-HI: IC40.5(C:I) ; also sheet 6
-REG-RD-LO: IC40.1(A:I) ; also sheet 6
-RLDH: IC40.8(D:O) R3.1 ; also sheet 2,3
-RLDL: IC40.4(B:O) R5.1 ; also sheet 2,3
-RRDH: IC40.6(C:O) R4.1 ; also sheet 2,3
-RRDL: IC40.2(A:O) R6.1 ; also sheet 2,3
N$6: IC36.1(A:G) IC39.3(A:O)
N$7: IC36.15(B:G) IC39.6(B:O)
N$14: IC36.4(A:Y0) J2.1 J3.1
N$16: IC36.5(A:Y1) J2.3 J3.3
N$18: IC36.6(A:Y2) J2.5 J3.5
N$20: IC36.7(A:Y3) J2.7 J3.7
N$22: IC36.12(B:Y0) J4.1 J5.1
N$24: IC36.11(B:Y1) J4.3 J5.3
N$26: IC36.10(B:Y2) J4.5 J5.5
N$27: IC36.9(B:Y3) J4.7 J5.7
REG-LD-ID0: IC37.14(B:A) IC38.2(A:A) ; also sheet 6
REG-LD-ID1: IC37.13(B:B) IC38.3(A:B) ; also sheet 6
REG-LD-ID2: IC36.14(B:A) ; also sheet 6
REG-LD-ID3: IC36.13(B:B) ; also sheet 6
REG-RD-ID0: IC37.2(A:A) IC38.14(B:A) ; also sheet 6
REG-RD-ID1: IC37.3(A:B) IC38.13(B:B) ; also sheet 6
REG-RD-ID2: IC36.2(A:A) ; also sheet 6
REG-RD-ID3: IC36.3(A:B) ; also sheet 6
VCC: R3.2 R4.2 R5.2 R6.2 ; also sheet 1,4,6

## Sheet 6 of 6: Bus
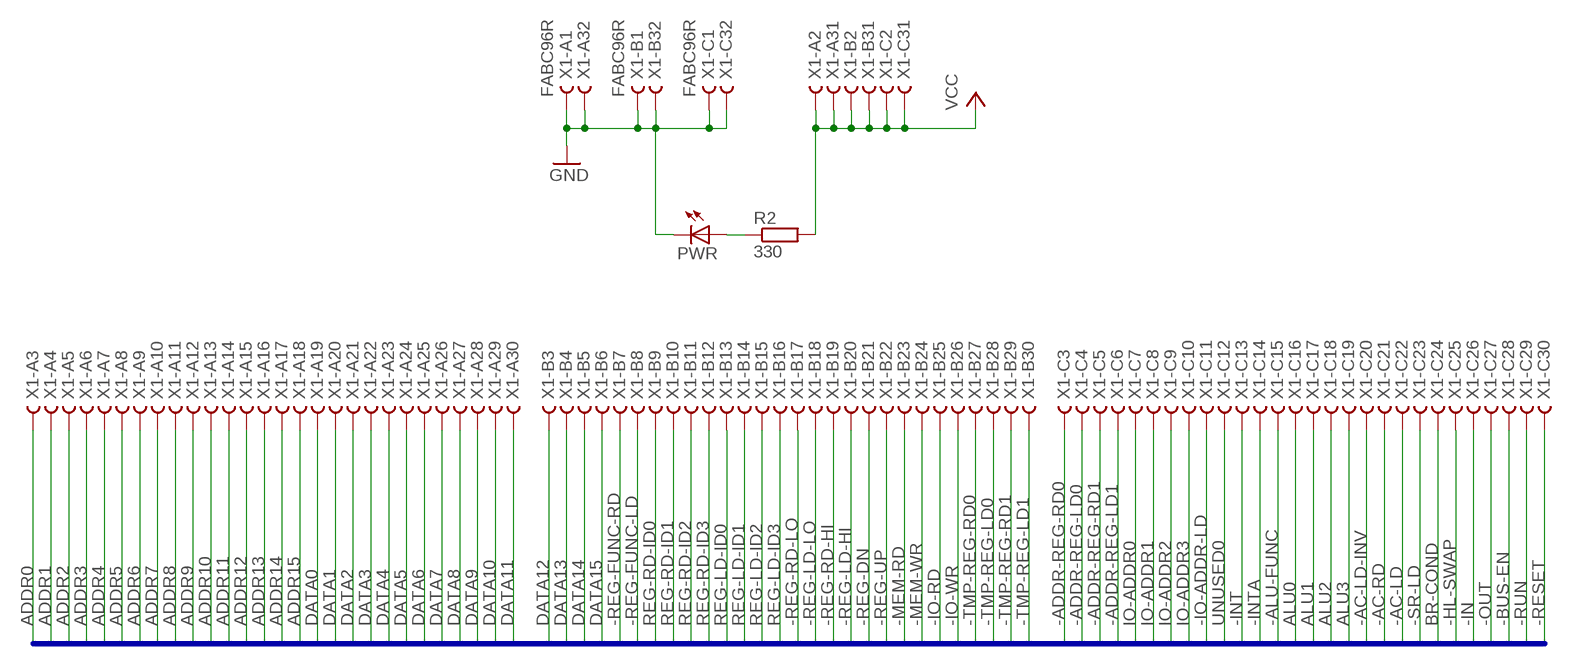
[diagram p5: schematic, sheet 6]

### Parts
PWR  LED5MM  [LED5MM]
R2  330  R0207/10  [0207/10]
X1  FABC96R  [FABC96R]

### Nets
-AC-LD: X1.C22
-AC-LD-INV: X1.C20
-AC-RD: X1.C21
-ADDR-REG-LD0: X1.C4
-ADDR-REG-LD1: X1.C6
-ADDR-REG-RD0: X1.C3
-ADDR-REG-RD1: X1.C5
-ALU-FUNC: X1.C15
-BUS-EN: X1.C28 ; also sheet 5
-HL-SWAP: X1.C25 ; also sheet 1
-IN: X1.C26
-INT: X1.C13
-INTA: X1.C14
-IO-ADDR-LD: X1.C11
-IO-RD: X1.B25
-IO-WR: X1.B26
-MEM-RD: X1.B23
-MEM-WR: X1.B24
-OUT: X1.C27
-REG-DN: X1.B21
-REG-FUNC-LD: X1.B8 ; also sheet 5
-REG-FUNC-RD: X1.B7 ; also sheet 5
-REG-LD-HI: X1.B20 ; also sheet 5
-REG-LD-LO: X1.B18 ; also sheet 5
-REG-RD-HI: X1.B19 ; also sheet 5
-REG-RD-LO: X1.B17 ; also sheet 5
-REG-UP: X1.B22
-RESET: X1.C30
-RUN: X1.C29
-SR-LD: X1.C23
-TMP-REG-LD0: X1.B28
-TMP-REG-LD1: X1.B30
-TMP-REG-RD0: X1.B27
-TMP-REG-RD1: X1.B29
ADDR0: X1.A3
ADDR1: X1.A4
ADDR2: X1.A5
ADDR3: X1.A6
ADDR4: X1.A7
ADDR5: X1.A8
ADDR6: X1.A9
ADDR7: X1.A10
ADDR8: X1.A11
ADDR9: X1.A12
ADDR10: X1.A13
ADDR11: X1.A14
ADDR12: X1.A15
ADDR13: X1.A16
ADDR14: X1.A17
ADDR15: X1.A18
ALU0: X1.C16
ALU1: X1.C17
ALU2: X1.C18
ALU3: X1.C19
BR-COND: X1.C24
DATA0: X1.A19 ; also sheet 1
DATA1: X1.A20 ; also sheet 1
DATA2: X1.A21 ; also sheet 1
DATA3: X1.A22 ; also sheet 1
DATA4: X1.A23 ; also sheet 1
DATA5: X1.A24 ; also sheet 1
DATA6: X1.A25 ; also sheet 1
DATA7: X1.A26 ; also sheet 1
DATA8: X1.A27 ; also sheet 1
DATA9: X1.A28 ; also sheet 1
DATA10: X1.A29 ; also sheet 1
DATA11: X1.A30 ; also sheet 1
DATA12: X1.B3 ; also sheet 1
DATA13: X1.B4 ; also sheet 1
DATA14: X1.B5 ; also sheet 1
DATA15: X1.B6 ; also sheet 1
GND: PWR.K(C) X1.A1 X1.A32 X1.B1 X1.B32 X1.C1 X1.C32 ; also sheet 1,4
IO-ADDR0: X1.C7
IO-ADDR1: X1.C8
IO-ADDR2: X1.C9
IO-ADDR3: X1.C10
N$5: PWR.A R2.1
REG-LD-ID0: X1.B13 ; also sheet 5
REG-LD-ID1: X1.B14 ; also sheet 5
REG-LD-ID2: X1.B15 ; also sheet 5
REG-LD-ID3: X1.B16 ; also sheet 5
REG-RD-ID0: X1.B9 ; also sheet 5
REG-RD-ID1: X1.B10 ; also sheet 5
REG-RD-ID2: X1.B11 ; also sheet 5
REG-RD-ID3: X1.B12 ; also sheet 5
UNUSED0: X1.C12
VCC: R2.2 X1.A2 X1.A31 X1.B2 X1.B31 X1.C2 X1.C31 ; also sheet 1,4,5

### Buses
ADDR[0..15],DATA[0..15],-REG-FUNC-RD,-REG-FUNC-LD,REG-RD-ID[0..3],REG-LD-ID[0..3],-REG-RD-LO,-REG-LD-LO,-REG-RD-HI,-REG-LD-HI,-REG-DN,-REG-UP,-MEM-RD,-MEM-WR,-IO-RD,-IO-WR,-TMP-REG-RD[0..1],-TMP-REG-LD[0..1],-ADDR-REG-RD[0..1],-ADDR-REG-LD[0..1],IO-ADDR[0..3],-IO-ADDR-LD,UNUSED0,-INT,-INTA,-ALU-FUNC,ALU[0..3],-AC-LD-INV,-AC-LD,-AC-RD,-SR-LD,BR-COND,-HL-SWAP,-IN,-OUT,-BUS-EN,-RESET,-RUN

## Power pins joined to a net without a drawn wire
GND: IC1.7(P:GND) IC2.7(P:GND) IC5.10(GND) IC6.10(GND) IC7.10(GND) IC8.7(P:GND) IC9.7(P:GND) IC10.10(GND) IC11.10(GND) IC12.10(GND) IC13.10(GND) IC14.7(P:GND) IC15.7(P:GND) IC16.10(GND) IC17.10(GND) IC18.10(GND) IC19.10(GND) IC20.7(P:GND) IC21.7(P:GND) IC22.10(GND) IC23.10(GND) IC24.10(GND) IC25.10(GND) IC26.7(P:GND) IC27.7(P:GND) IC28.10(GND) IC29.10(GND) IC30.10(GND) IC31.10(GND) IC32.10(P:GND) IC33.10(P:GND) IC34.10(P:GND) IC35.10(P:GND) IC36.8(P:GND) IC37.8(P:GND) IC38.8(P:GND) IC39.7(P:GND) IC40.7(P:GND)
VCC: IC1.14(P:VCC) IC2.14(P:VCC) IC5.20(VCC) IC6.20(VCC) IC7.20(VCC) IC8.14(P:VCC) IC9.14(P:VCC) IC10.20(VCC) IC11.20(VCC) IC12.20(VCC) IC13.20(VCC) IC14.14(P:VCC) IC15.14(P:VCC) IC16.20(VCC) IC17.20(VCC) IC18.20(VCC) IC19.20(VCC) IC20.14(P:VCC) IC21.14(P:VCC) IC22.20(VCC) IC23.20(VCC) IC24.20(VCC) IC25.20(VCC) IC26.14(P:VCC) IC27.14(P:VCC) IC28.20(VCC) IC29.20(VCC) IC30.20(VCC) IC31.20(VCC) IC32.20(P:VCC) IC33.20(P:VCC) IC34.20(P:VCC) IC35.20(P:VCC) IC36.16(P:VCC) IC37.16(P:VCC) IC38.16(P:VCC) IC39.14(P:VCC) IC40.14(P:VCC)

## Library data of the parts
C1-C38 = rcl:C-US: CAPACITOR, American symbol
IC1 = 74xx-us:74*266: Quadruple EXCLUSIVE-NOR (XNOR), open-collector
IC2 = 74xx-us:74*86: Quad 2-input EXCLUSIV-OR (XOR) gate
IC5-IC7 = 74xx-us:74*245: Octal BUS TRANSCEIVER, 3-state
IC8 IC14 IC20 IC26 IC39 = 74xx-us:74*32: Quad 2-input OR gate
IC9 IC15 IC21 IC27 = 74xx-us:74*02: Quad 2-input NOR gate
IC10-IC13 IC16-IC19 IC22-IC25 IC28-IC31 = 74xx-us:74*374: Octal D type transparent LATCH, edge triggered
IC32-IC35 = 74xx-us:74*244: Octal BUFFER and LINE DRIVER, 3-state
IC36-IC38 = 74xx-us:74*139: Dual 2-line to 4-line DECODER/DEMULTIPLEXER
IC40 = 74xx-us:74*07: Hex BUFFER, open collector high-voltage output
J1 = SparkFun-Connectors:M02: Standard 2-pin 0.1" header. Use with - straight break away headers ( PRT-00116) - right angle break away headers (PRT-00553) - swiss pins (PRT-00743) - machine pins (PRT-00117) - female headers (PRT-00115) Molex polarized connector foot print use with: PRT-08233 with associated crimp pins and housings. 2.54_SCREWTERM for use with PRT-10571. 3.5mm Screw Terminal footprints for PRT-08084 5mm Screw Terminal footprints for use with PRT-08432
J2-J5 = SparkFun-Connectors:M04X2: .1" header, two rows of four.
JP1 = pinhead:PINHD-2X20: PIN HEADER
PWR = led:LED: LED OSRAM: - CHIPLED LG R971, LG N971, LY N971, LG Q971, LY Q971, LO R971, LY R971 LH N974, LH R974 LS Q976, LO Q976, LY Q976 LO Q996 - Hyper CHIPLED LW Q18S LB Q993, LB Q99A, LB R99A - SideLED LS A670, LO A670, LY A670, LG A670, LP A670 LB A673, LV A673, LT A673, LW A673 LH A674 LY A675 LS A676, LA A676, LO A676, LY A676, LW A676 LS A679, LY A679, LG A679 - Hyper Micro SIDELED® LS Y876, LA Y876, LO Y876, LY Y876 LT Y87S - SmartLED LW L88C, LW L88S LB L89C, LB L89S, LG L890 LS L89K, LO L89K, LY L89K LS L896, LA L896, LO L896, LY L896 - TOPLED LS T670, LO T670, LY T670, LG T670, LP T670 LSG T670, LSP T670, LSY T670, LOP T670, LYG T670 LG T671, LOG T671, LSG T671 LB T673, LV T673, LT T673, LW T673 LH T674 LS T676, LA T676, LO T676, LY T676, LB T676, LH T676, LSB T676, LW T676 LB T67C, LV T67C, LT T67C, LS T67K, LO T67K, LY T67K, LW E67C LS E67B, LA E67B, LO E67B, LY E67B, LB E67C, LV E67C, LT E67C LW T67C LS T679, LY T679, LG T679 LS T770, LO T770, LY T770, LG T770, LP T770 LB T773, LV T773, LT T773, LW T773 LH T774 LS E675, LA E675, LY E675, LS T675 LS T776, LA T776, LO T776, LY T776, LB T776 LHGB T686 LT T68C, LB T68C - Hyper Mini TOPLED® LB M676 - Mini TOPLED Santana® LG M470 LS M47K, LO M47K, LY M47K Source: http://www.osram.convergy.de LUXEON: - LUMILED® LXK2-PW12-R00, LXK2-PW12-S00, LXK2-PW14-U00, LXK2-PW14-V00 LXK2-PM12-R00, LXK2-PM12-S00, LXK2-PM14-U00 LXK2-PE12-Q00, LXK2-PE12-R00, LXK2-PE12-S00, LXK2-PE14-T00, LXK2-PE14-U00 LXK2-PB12-K00, LXK2-PB12-L00, LXK2-PB12-M00, LXK2-PB14-N00, LXK2-PB14-P00, LXK2-PB14-Q00 LXK2-PR12-L00, LXK2-PR12-M00, LXK2-PR14-Q00, LXK2-PR14-R00 LXK2-PD12-Q00, LXK2-PD12-R00, LXK2-PD12-S00 LXK2-PH12-R00, LXK2-PH12-S00 LXK2-PL12-P00, LXK2-PL12-Q00, LXK2-PL12-R00 Source: www.luxeon.com KINGBRIGHT: KA-3528ASYC Source: www.kingbright.com
R1-R6 = eagle-ltspice:R: RESISTOR, European symbol; SPICEMODEL: NONE; SPICEPREFIX: R
RN1 RN2 = resistor-net:RNX8: RESISTOR NETWORK; OC_FARNELL: unknown; OC_NEWARK: unknown
X1 = con-vg:FABC96R: CONNECTOR female, 96 pins, type R, rows ABC, grid 2.54 mm

## Net classes
1 GND: width 1 mm
2 5V: width 1 mm